# EasyEDA Pro project Cerberus_Power_V02.eprj, schematic Schematic1

## Sheets
1 P1: Board Name: Cerberus_Power_V02; Create Date: 2024-10-24; Page Name: P1; Project Name: Cerberus_Power_V02; Schematic Name: Schematic1; Update Date: 2024-10-29
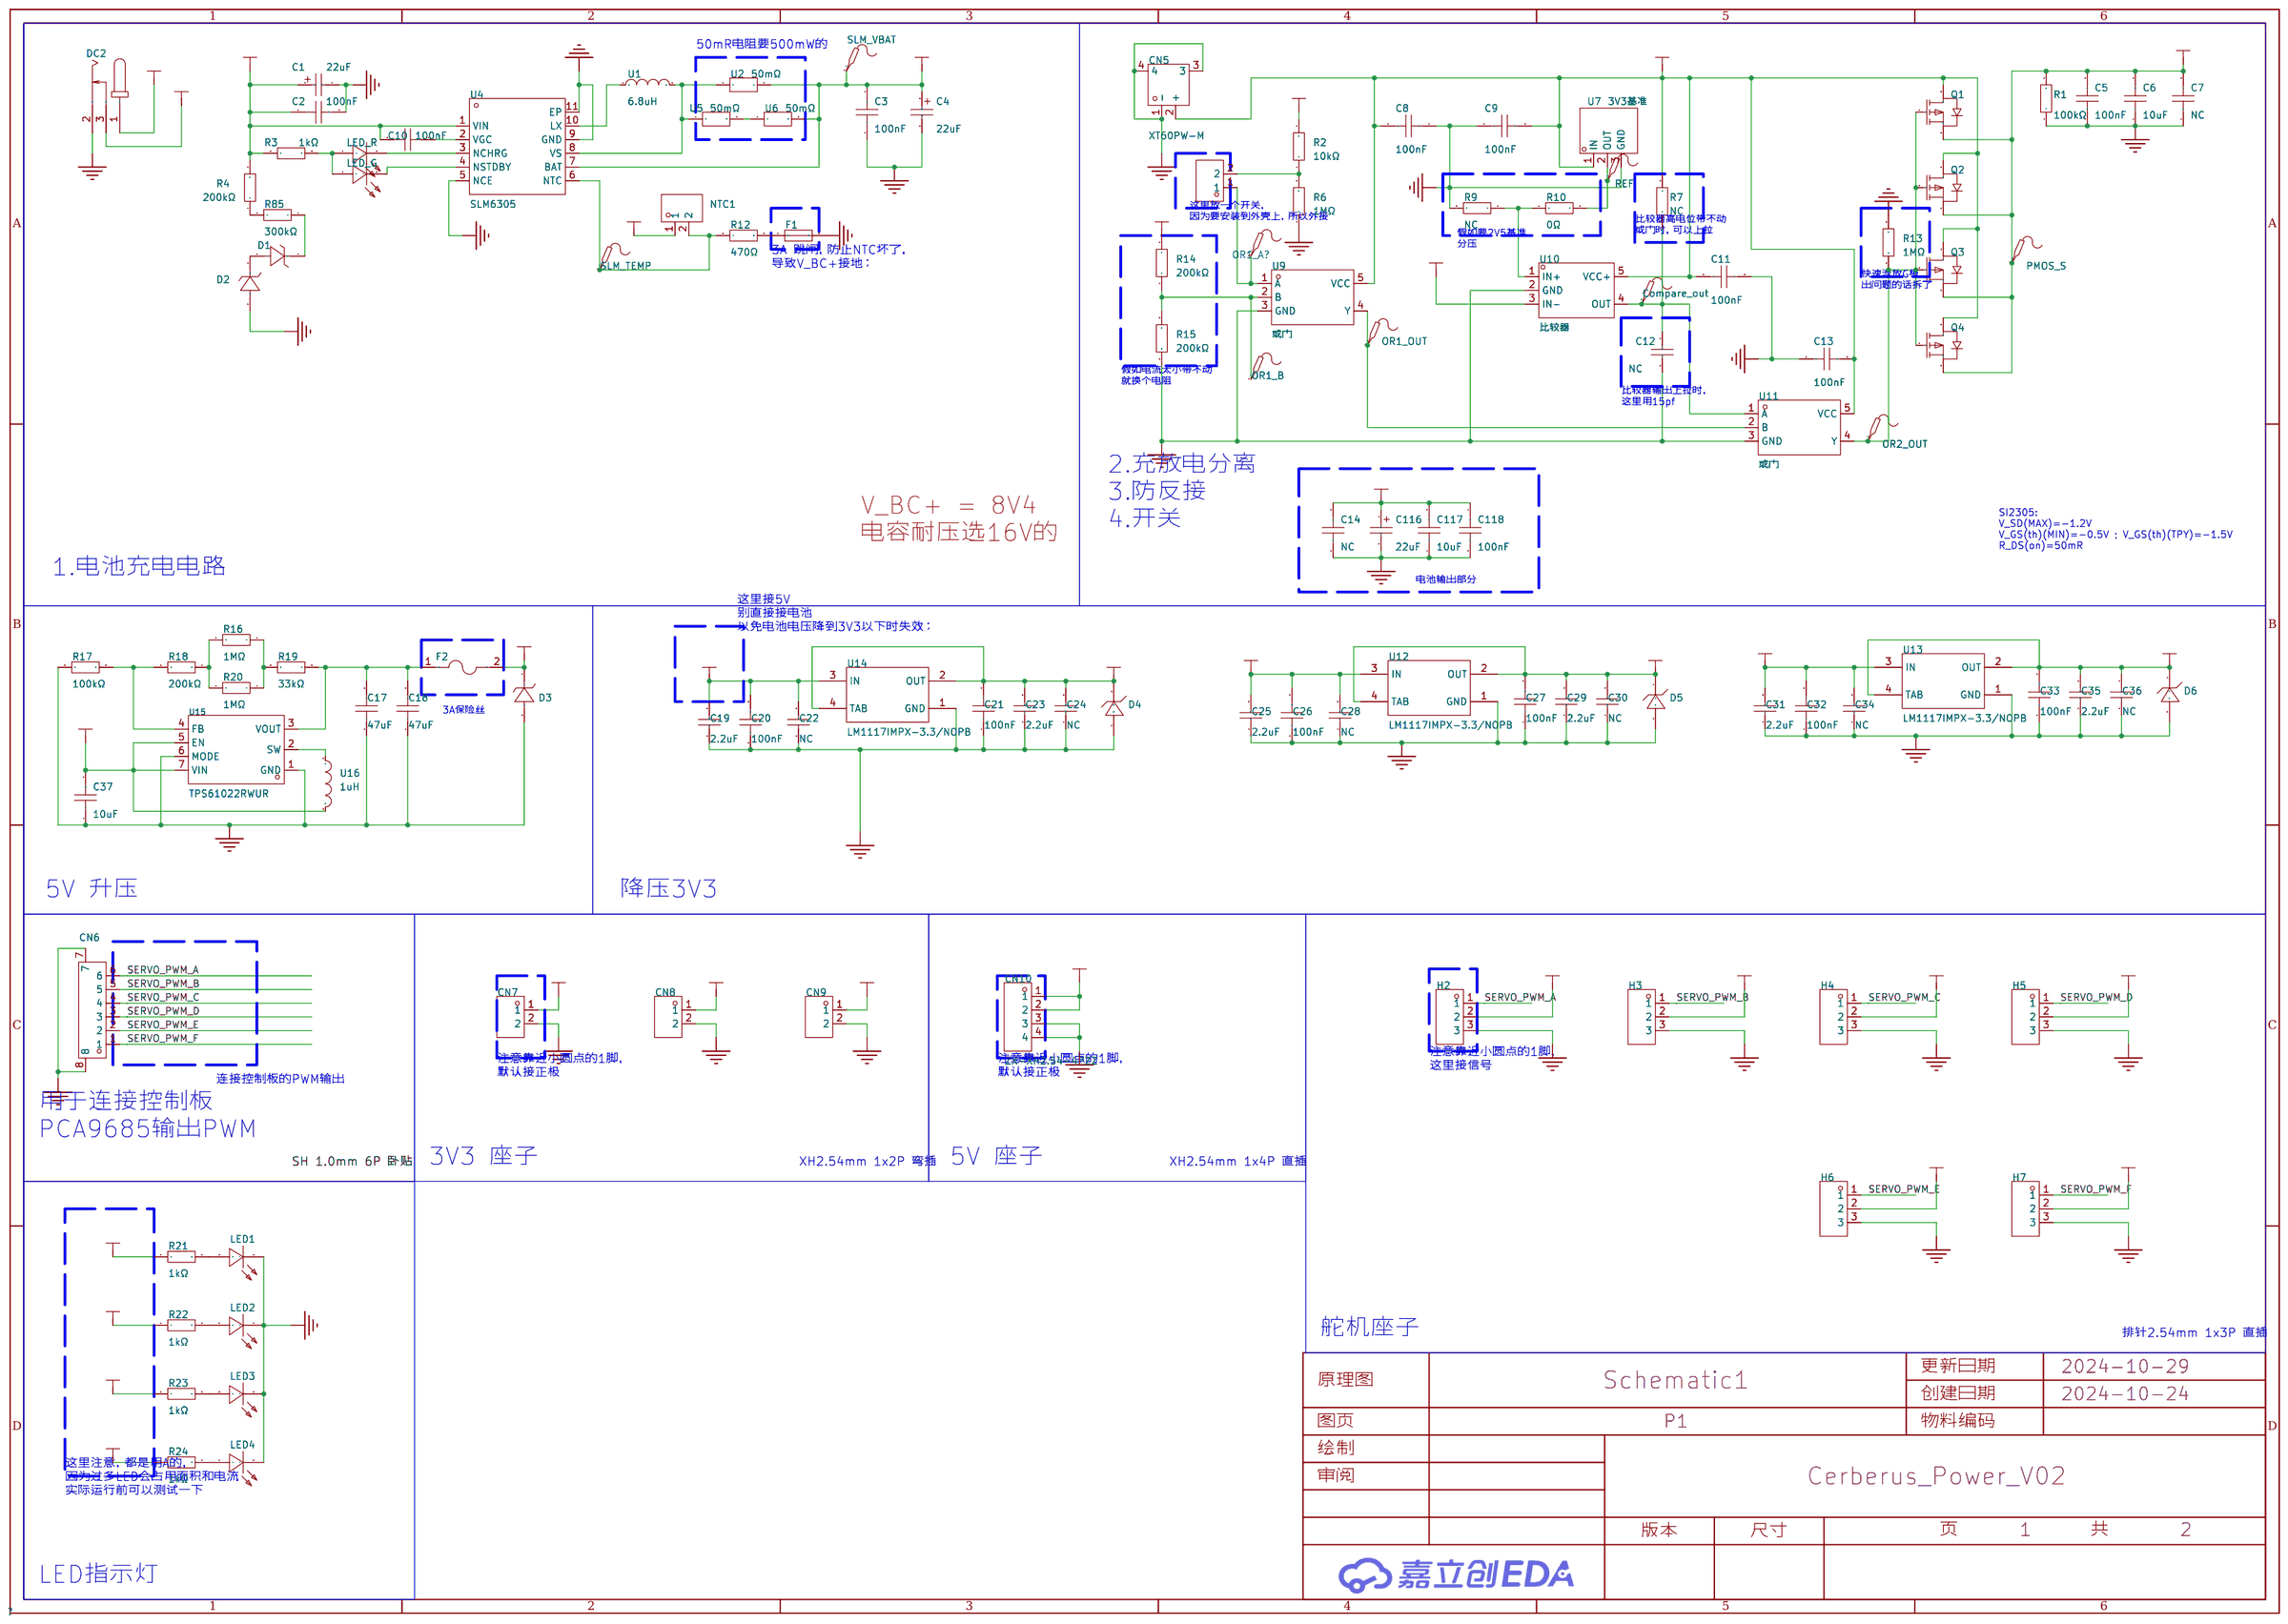
[diagram p0: P1]
2 BOOST 7V4: Create Date: 2024-10-26; Page Name: BOOST 7V4; Update Date: 2024-10-28; Company: 嘉立创EDA; Page Size: A4; Version: V1.0
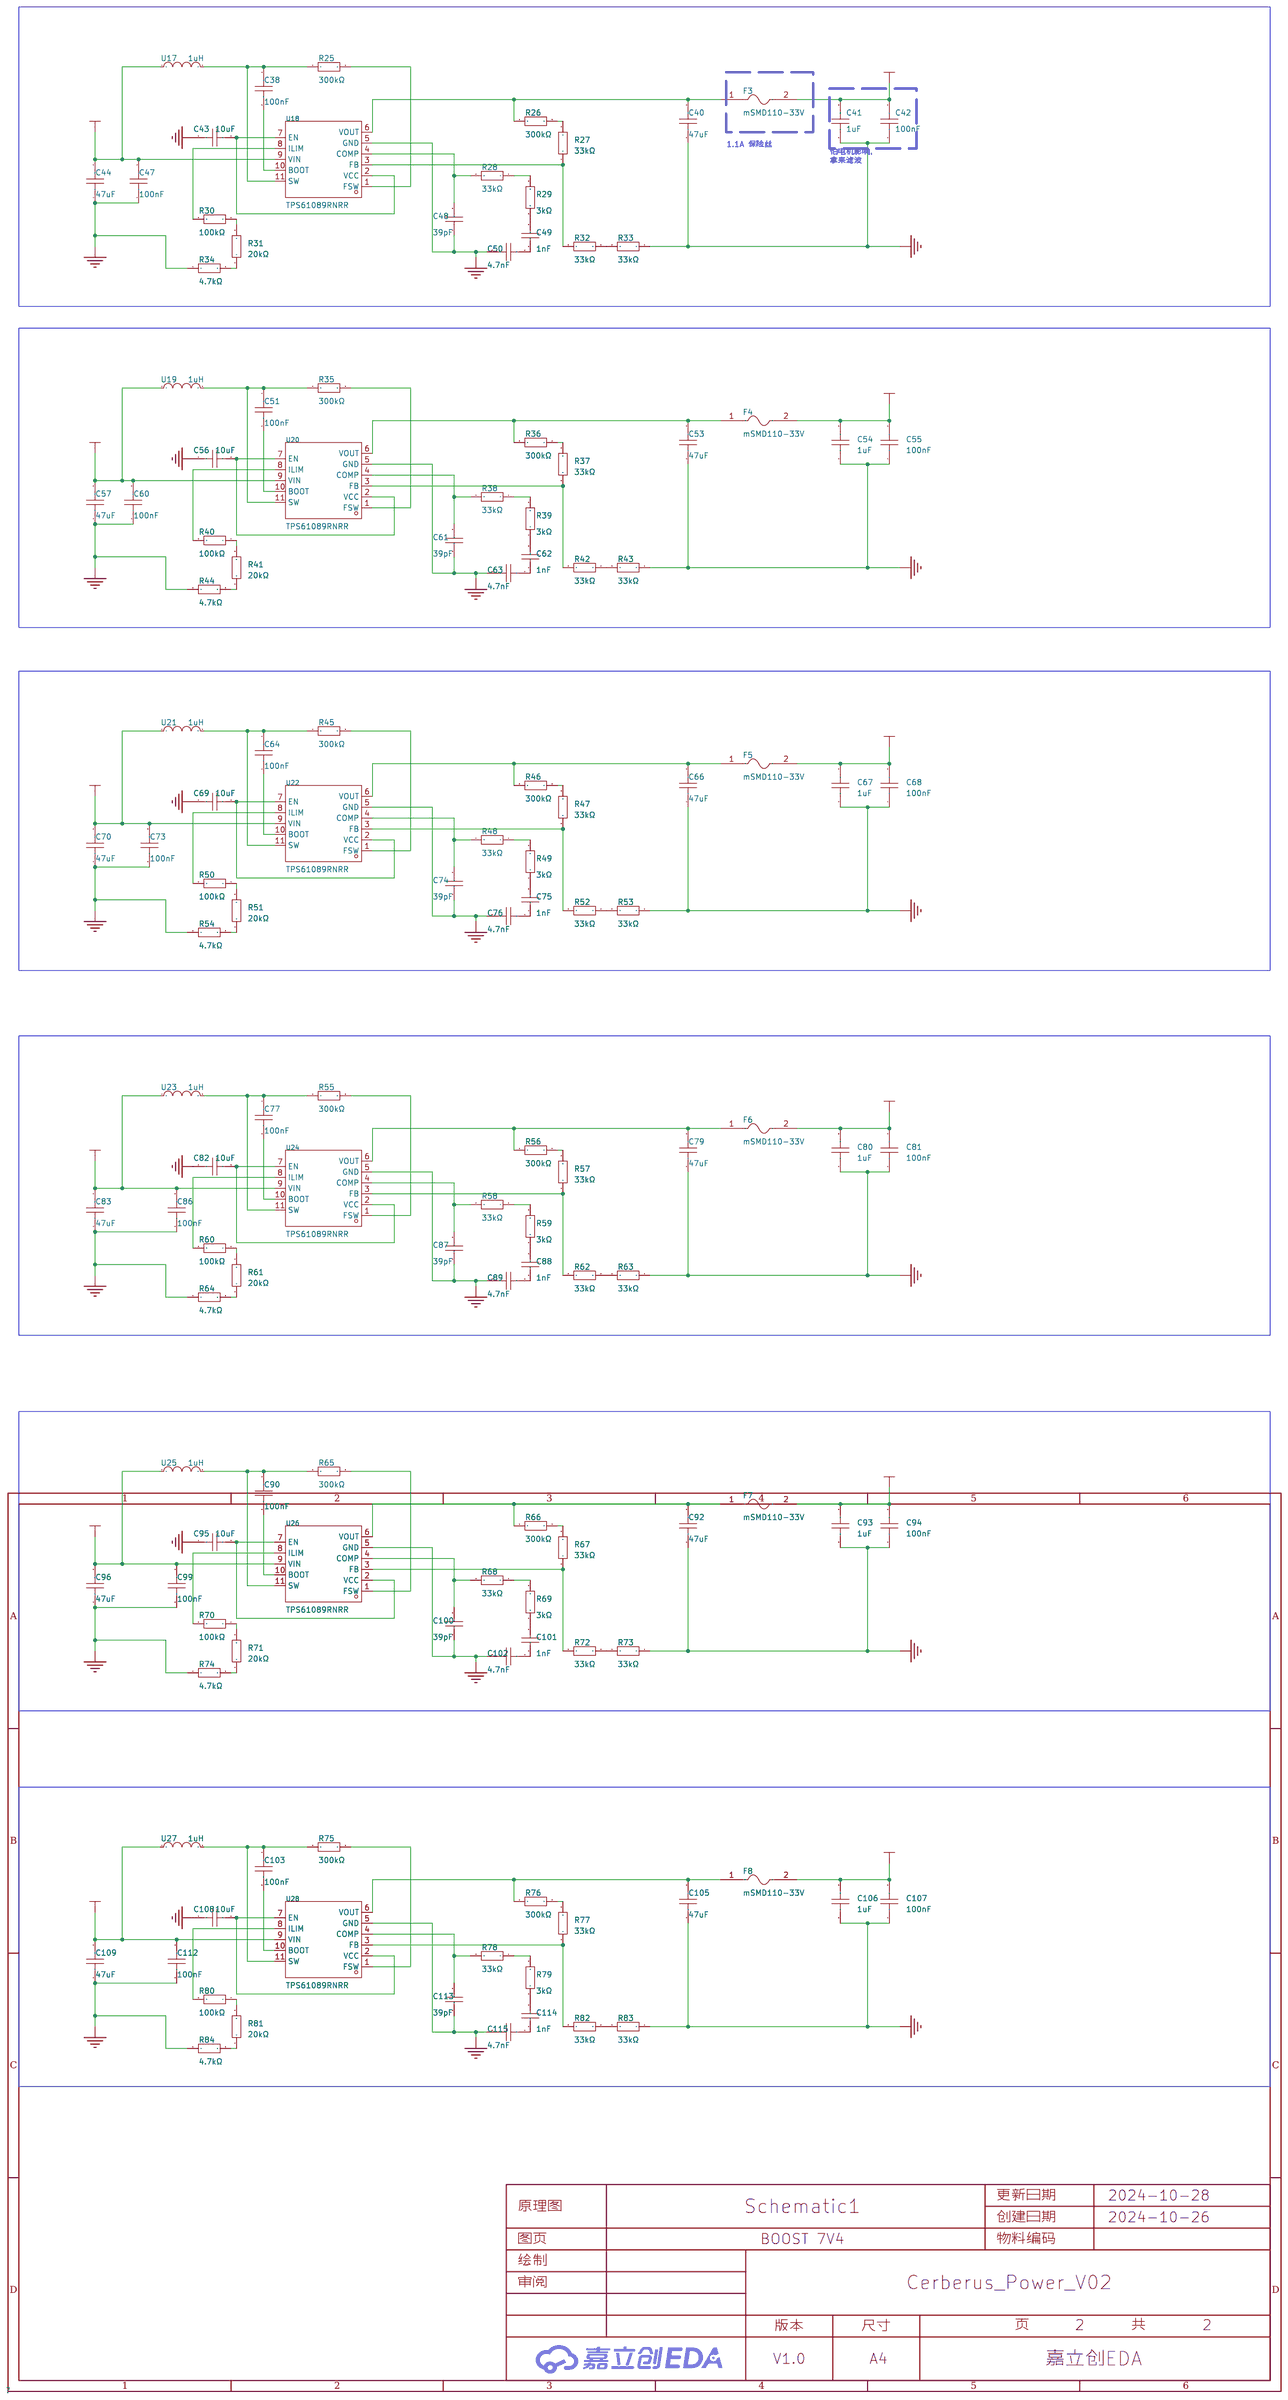
[diagram p1: BOOST 7V4]

## Parts
sheet BOOST 7V4
C38  100nF  [C0603]
C40  47uF  [C0805]
C41  1uF  [C0603]
C42  100nF  [C0603]
C43  10uF  [C0603]
C44  47uF  [C0805]
C47  100nF  [C0603]
C48  39pF  [C0603]
C49  1nF  [C0603]
C50  4.7nF  [C0603]
C51  100nF  [C0603]
C53  47uF  [C0805]
C54  1uF  [C0603]
C55  100nF  [C0603]
C56  10uF  [C0603]
C57  47uF  [C0805]
C60  100nF  [C0603]
C61  39pF  [C0603]
C62  1nF  [C0603]
C63  4.7nF  [C0603]
C64  100nF  [C0603]
C66  47uF  [C0805]
C67  1uF  [C0603]
C68  100nF  [C0603]
C69  10uF  [C0603]
C70  47uF  [C0805]
C73  100nF  [C0603]
C74  39pF  [C0603]
C75  1nF  [C0603]
C76  4.7nF  [C0603]
C77  100nF  [C0603]
C79  47uF  [C0805]
C80  1uF  [C0603]
C81  100nF  [C0603]
C82  10uF  [C0603]
C83  47uF  [C0805]
C86  100nF  [C0603]
C87  39pF  [C0603]
C88  1nF  [C0603]
C89  4.7nF  [C0603]
C90  100nF  [C0603]
C92  47uF  [C0805]
C93  1uF  [C0603]
C94  100nF  [C0603]
C95  10uF  [C0603]
C96  47uF  [C0805]
C99  100nF  [C0603]
C100  39pF  [C0603]
C101  1nF  [C0603]
C102  4.7nF  [C0603]
C103  100nF  [C0603]
C105  47uF  [C0805]
C106  1uF  [C0603]
C107  100nF  [C0603]
C108  10uF  [C0603]
C109  47uF  [C0805]
C112  100nF  [C0603]
C113  39pF  [C0603]
C114  1nF  [C0603]
C115  4.7nF  [C0603]
F3  mSMD110-33V  [F1812]
F4  mSMD110-33V  [F1812]
F5  mSMD110-33V  [F1812]
F6  mSMD110-33V  [F1812]
F7  mSMD110-33V  [F1812]
F8  mSMD110-33V  [F1812]
R25  300kΩ  [R0603]
R26  300kΩ  [R0603]
R27  33kΩ  [R0603]
R28  33kΩ  [R0603]
R29  3kΩ  [R0603]
R30  100kΩ  [R0603]
R31  20kΩ  [R0603]
R32  33kΩ  [R0603]
R33  33kΩ  [R0603]
R34  4.7kΩ  [R0603]
R35  300kΩ  [R0603]
R36  300kΩ  [R0603]
R37  33kΩ  [R0603]
R38  33kΩ  [R0603]
R39  3kΩ  [R0603]
R40  100kΩ  [R0603]
R41  20kΩ  [R0603]
R42  33kΩ  [R0603]
R43  33kΩ  [R0603]
R44  4.7kΩ  [R0603]
R45  300kΩ  [R0603]
R46  300kΩ  [R0603]
R47  33kΩ  [R0603]
R48  33kΩ  [R0603]
R49  3kΩ  [R0603]
R50  100kΩ  [R0603]
R51  20kΩ  [R0603]
R52  33kΩ  [R0603]
R53  33kΩ  [R0603]
R54  4.7kΩ  [R0603]
R55  300kΩ  [R0603]
R56  300kΩ  [R0603]
R57  33kΩ  [R0603]
R58  33kΩ  [R0603]
R59  3kΩ  [R0603]
R60  100kΩ  [R0603]
R61  20kΩ  [R0603]
R62  33kΩ  [R0603]
R63  33kΩ  [R0603]
R64  4.7kΩ  [R0603]
R65  300kΩ  [R0603]
R66  300kΩ  [R0603]
R67  33kΩ  [R0603]
R68  33kΩ  [R0603]
R69  3kΩ  [R0603]
R70  100kΩ  [R0603]
R71  20kΩ  [R0603]
R72  33kΩ  [R0603]
R73  33kΩ  [R0603]
R74  4.7kΩ  [R0603]
R75  300kΩ  [R0603]
R76  300kΩ  [R0603]
R77  33kΩ  [R0603]
R78  33kΩ  [R0603]
R79  3kΩ  [R0603]
R80  100kΩ  [R0603]
R81  20kΩ  [R0603]
R82  33kΩ  [R0603]
R83  33kΩ  [R0603]
R84  4.7kΩ  [R0603]
U17  1uH  [IND-SMD_L7.0-W6.6]
U18  TPS61089RNRR  [VQFN-HR_L2.5-W2.0-P0.50-TL-EP]
U19  1uH  [IND-SMD_L7.0-W6.6]
U20  TPS61089RNRR  [VQFN-HR_L2.5-W2.0-P0.50-TL-EP]
U21  1uH  [IND-SMD_L7.0-W6.6]
U22  TPS61089RNRR  [VQFN-HR_L2.5-W2.0-P0.50-TL-EP]
U23  1uH  [IND-SMD_L7.0-W6.6]
U24  TPS61089RNRR  [VQFN-HR_L2.5-W2.0-P0.50-TL-EP]
U25  1uH  [IND-SMD_L7.0-W6.6]
U26  TPS61089RNRR  [VQFN-HR_L2.5-W2.0-P0.50-TL-EP]
U27  1uH  [IND-SMD_L7.0-W6.6]
U28  TPS61089RNRR  [VQFN-HR_L2.5-W2.0-P0.50-TL-EP]
sheet P1
C1  22uF  [CASE-B_3528]
C2  100nF  [C0603]
C3  100nF  [C0603]
C4  22uF  [CASE-B_3528]
C5  100nF  [C0603]
C6  10uF  [C0603]
C7  22uF  [C0603]
C8  100nF  [C0603]
C9  100nF  [C0603]
C10  100nF  [C0603]
C11  100nF  [C0603]
C12  15pF  [C0603]
C13  100nF  [C0603]
C14  NC  [C0603]
C17  47uF  [C0805]
C18  47uF  [C0805]
C19  2.2uF  [C0603]
C20  100nF  [C0603]
C21  100nF  [C0603]
C22  NC  [C0603]
C23  2.2uF  [C0603]
C24  NC  [C0603]
C25  2.2uF  [C0603]
C26  100nF  [C0603]
C27  100nF  [C0603]
C28  NC  [C0603]
C29  2.2uF  [C0603]
C30  NC  [C0603]
C31  2.2uF  [C0603]
C32  100nF  [C0603]
C33  100nF  [C0603]
C34  NC  [C0603]
C35  2.2uF  [C0603]
C36  NC  [C0603]
C37  10uF  [C0603]
C116  22uF  [CASE-B_3528]
C117  10uF  [C0603]
C118  100nF  [C0603]
CN5  XT60PW-M  [CONN-TH_XT60PW-M]
CN6  WAFER-SH1.0-6PWB  [CONN-SMD_6P-P1.00_XUNPU_WAFER-SH1.0-6PWB]
CN7  ZX-XH2.54-2PWZ  [CONN-TH_2P-P2.50_ZX-XH2.54-2PWZ]
CN8  ZX-XH2.54-2PWZ  [CONN-TH_2P-P2.50_ZX-XH2.54-2PWZ]
CN9  ZX-XH2.54-2PWZ  [CONN-TH_2P-P2.50_ZX-XH2.54-2PWZ]
CN10  ZX-XH2.54-4PZZ  [CONN-TH_4P-P2.50_4PIN]
Compare_out  -  [Test-Point-0.5mm]
D1  BZT52B5V1S  [sod-323_l1.7-w1.3-ls2.6-rd]
D2  BZT52C3V3S  [sod-323_l1.7-w1.3-ls2.6-rd]
D3  BZT52B5V1S  [sod-323_l1.7-w1.3-ls2.6-rd]
D4  BZT52C3V3S  [SOD-323_L1.8-W1.3-LS2.5-RD]
D5  BZT52C3V3S  [SOD-323_L1.8-W1.3-LS2.5-RD]
D6  BZT52C3V3S  [SOD-323_L1.8-W1.3-LS2.5-RD]
DC2  DC005  [DC-IN-TH_DC005]
F1  BSMD1812-150-24V  [F1812]
F2  JFC1206-1300FS  [F1206]
H1  PZ254V-11-02P  [HDR-TH_2P-P2.54-V-M]
H2  PZ254V-11-03P  [HDR-TH_3P-P2.54-V-M]
H3  PZ254V-11-03P  [HDR-TH_3P-P2.54-V-M]
H4  PZ254V-11-03P  [HDR-TH_3P-P2.54-V-M]
H5  PZ254V-11-03P  [HDR-TH_3P-P2.54-V-M]
H6  PZ254V-11-03P  [HDR-TH_3P-P2.54-V-M]
H7  PZ254V-11-03P  [HDR-TH_3P-P2.54-V-M]
LED1  NCD0805R1  [LED0805-R-RD]
LED2  NCD0805R1  [LED0805-R-RD]
LED3  NCD0805R1  [LED0805-R-RD]
LED4  NCD0805R1  [LED0805-R-RD]
LED_G  NCD0805R1  [LED0805-R-RD]
LED_R  NCD0805R1  [LED0805-R-RD]
NTC1  ZX-XH2.54-2PZZ  [CONN-TH_2P-P2.50_HX25003-2A]
OR1_A?#1  -  [Test-Point-0.5mm]
OR1_B  -  [Test-Point-0.5mm]
OR1_OUT  -  [Test-Point-0.5mm]
OR2_OUT  -  [Test-Point-0.5mm]
PMOS_S  -  [Test-Point-0.5mm]
Q1  SI2305  [SOT-23-3_L2.9-W1.6-P1.90-LS2.8-BR]
Q2  SI2305  [SOT-23-3_L2.9-W1.6-P1.90-LS2.8-BR]
Q3  SI2305  [SOT-23-3_L2.9-W1.6-P1.90-LS2.8-BR]
Q4  SI2305  [SOT-23-3_L2.9-W1.6-P1.90-LS2.8-BR]
R1  100kΩ  [R1206]
R2  10kΩ  [R0402]
R3  1kΩ  [R0603]
R4  200kΩ  [R0603]
R6  1MΩ  [R0402]
R7  4.7kΩ  [R0603]
R9  10kΩ  [R0402]
R10  0Ω  [R0603]
R12  470Ω  [R0603]
R13  1MΩ  [R0603]
R14  200kΩ  [R0603]
R15  200kΩ  [R0603]
R16  1MΩ  [R0402]
R17  100kΩ  [R0603]
R18  200kΩ  [R0603]
R19  33kΩ  [R0603]
R20  1MΩ  [R0402]
R21  1kΩ  [R0603]
R22  1kΩ  [R0603]
R23  1kΩ  [R0603]
R24  1kΩ  [R0603]
R85  300kΩ  [R0603]
REF  -  [Test-Point-0.5mm]
SLM_TEMP  -  [Test-Point-0.5mm]
SLM_VBAT  -  [Test-Point-0.5mm]
U1  6.8uH  [IND-SMD_L5.7-W5.2]
U2  50mΩ  [R1206]
U4  SLM6305  [TDFN-10_L3.0-W3.0-P0.50-BL-EP]
U5  50mΩ  [R1206]
U6  50mΩ  [R1206]
U7  3V3基准  [SOT-23-3_L3.0-W1.7-P0.95-LS2.9-BR]
U9  或门  [SOT-23-5_L2.9-W1.6-P0.95-LS2.8-BR]
U10  比较器  [SOT-23-5_L3.0-W1.7-P0.95-LS2.8-BR]
U11  或门  [SOT-23-5_L2.9-W1.6-P0.95-LS2.8-BR]
U12  LM1117IMPX-3.3/NOPB  [SOT-223_L6.5-W3.5-P2.30-LS7.0-BR]
U13  LM1117IMPX-3.3/NOPB  [SOT-223_L6.5-W3.5-P2.30-LS7.0-BR]
U14  LM1117IMPX-3.3/NOPB  [SOT-223_L6.5-W3.5-P2.30-LS7.0-BR]
U15  TPS61022RWUR  [VQFN-7_L2.0-W2.0-P0.55-TL_RWU]
U16  1uH  [IND-SMD_L7.0-W6.6]

## Library data of the parts
C2 C3 C5 C8-C11 C13 C20 C21 C26 C27 C32 C33 C38 C42 C47 C51 C55 C60 C64 C68 C73 C77 C81 C86 C90 C94 C99 C103 C107 C112 C118 = CGA0603X7R104K500JT: LCSC Part Name: 100nF ±10% 50V; Supplier Part: C6119867; Manufacturer: HRE(芯声); Supplier Footprint: 0603; JLCPCB Part Class: 扩展库; Supplier: LCSC; Tolerance: ±10%; Voltage Rated: 50V; Temperature Coefficient: X7R
C17 C18 C40 C44 C53 C57 C66 C70 C79 C83 C92 C96 C105 C109 = CGA0805X5R476M100MT: LCSC Part Name: 47uF ±20% 10V; Supplier Part: C6119904; Manufacturer: HRE(芯声); Supplier Footprint: 0805; JLCPCB Part Class: 扩展库; Supplier: LCSC; Tolerance: ±20%; Voltage Rated: 10V; Temperature Coefficient: X5R
C41 C54 C67 C80 C93 C106 = CGA0603X5R105K160JT: LCSC Part Name: 1uF ±10% 16V; Supplier Part: C6119849; Manufacturer: HRE(芯声); Supplier Footprint: 0603; JLCPCB Part Class: 扩展库; Supplier: LCSC; Tolerance: ±10%; Voltage Rated: 16V; Temperature Coefficient: X5R
C6 C14 C37 C43 C56 C69 C82 C95 C108 C117 = HGC0603R5106M160NTHJ: LCSC Part Name: 10uF ±20% 16V; Supplier Part: C7472959; Manufacturer: Chinocera(华瓷); Supplier Footprint: 0603; JLCPCB Part Class: 扩展库; Datasheet: https://atta.szlcsc.com/upload/public/pdf/source/20240320/FAC3FEC40A78BC5CCCE96C232A94D860.pdf; Supplier: LCSC; Tolerance: ±20%; Voltage Rated: 16V; Temperature Coefficient: X5R
C48 C61 C74 C87 C100 C113 = CC0603JRNPO9BN390: LCSC Part Name: 39pF ±5% 50V; Supplier Part: C107049; Manufacturer: YAGEO(国巨); Supplier Footprint: 0603; JLCPCB Part Class: 扩展库; Datasheet: https://atta.szlcsc.com/upload/public/pdf/source/20170914/C128857_1505359892143968080.pdf; Supplier: LCSC; Tolerance: ±5%; Voltage Rated: 50V; Temperature Coefficient: NP0
C49 C62 C75 C88 C101 C114 = CC0603KRX7R9BB102: LCSC Part Name: 1nF ±10% 50V; Supplier Part: C100040; Manufacturer: YAGEO(国巨); Supplier Footprint: 0603; JLCPCB Part Class: 扩展库; Datasheet: https://atta.szlcsc.com/upload/public/pdf/source/20180910/C282072_33301C7F631E79921B82A8DAC6BCC5B3.pdf; Supplier: LCSC; Tolerance: ±10%; Voltage Rated: 50V; Temperature Coefficient: X7R
C50 C63 C76 C89 C102 C115 = CGA0603X7R472K500JT: LCSC Part Name: 4.7nF ±10% 50V; Supplier Part: C7503499; Manufacturer: HRE(芯声); Supplier Footprint: 0603; JLCPCB Part Class: 扩展库; Supplier: LCSC; Tolerance: ±10%; Voltage Rated: 50V; Temperature Coefficient: X7R
F3-F8 = mSMD110-33V: LCSC Part Name: 33V 1.1A 1812自恢复; Supplier Part: C70119; Manufacturer: 台湾陆海; Supplier Footprint: 1812; JLCPCB Part Class: 扩展库; Datasheet: https://atta.szlcsc.com/upload/public/pdf/source/20220506/AB1AE108CC65B75A3068EC09620F583D.pdf; Supplier: LCSC; Operating Voltage (Max): 33V; Current Rating (Max): 100A; Hold Current: 1.1A; Trip Current: 2.2A
R25 R26 R35 R36 R45 R46 R55 R56 R65 R66 R75 R76 R85 = 0603WAF3003T5E: LCSC Part Name: 300kΩ ±1% 100mW 厚膜电阻; Supplier Part: C23024; Manufacturer: UNI-ROYAL(厚声); Supplier Footprint: 0603; JLCPCB Part Class: 基础库; Datasheet: https://atta.szlcsc.com/upload/public/pdf/source/20200306/C422600_1E6D84923E4A46A82E41ADD87F860B5C.pdf; Supplier: LCSC; Type: 厚膜电阻; Tolerance: ±1%; Power(Watts): 100mW; Overload Voltage (Max): 75V; Temperature Coefficient: ±100ppm/℃; Operating Temperature Range: -55℃~+155℃
R19 R27 R28 R32 R33 R37 R38 R42 R43 R47 R48 R52 R53 R57 R58 R62 R63 R67 R68 R72 R73 R77 R78 R82 R83 = 0603WAF3302T5E: LCSC Part Name: 33kΩ ±1% 100mW 厚膜电阻; Supplier Part: C4216; Manufacturer: UNI-ROYAL(厚声); Supplier Footprint: 0603; JLCPCB Part Class: 基础库; Datasheet: https://atta.szlcsc.com/upload/public/pdf/source/20200306/C422600_1E6D84923E4A46A82E41ADD87F860B5C.pdf; Supplier: LCSC; Type: 厚膜电阻; Tolerance: ±1%; Power(Watts): 100mW; Overload Voltage (Max): 75V; Temperature Coefficient: ±100ppm/℃; Operating Temperature Range: -55℃~+155℃
R29 R39 R49 R59 R69 R79 = 0603WAF3001T5E: LCSC Part Name: 3kΩ ±1% 100mW 厚膜电阻; Supplier Part: C4211; Manufacturer: UNI-ROYAL(厚声); Supplier Footprint: 0603; JLCPCB Part Class: 基础库; Datasheet: https://atta.szlcsc.com/upload/public/pdf/source/20200306/C422600_1E6D84923E4A46A82E41ADD87F860B5C.pdf; Supplier: LCSC; Type: 厚膜电阻; Tolerance: ±1%; Power(Watts): 100mW; Overload Voltage (Max): 75V; Temperature Coefficient: ±100ppm/℃; Operating Temperature Range: -55℃~+155℃
R17 R30 R40 R50 R60 R70 R80 = 0603WAF1003T5E: LCSC Part Name: 100kΩ ±1% 100mW 厚膜电阻; Supplier Part: C25803; Manufacturer: UNI-ROYAL(厚声); Supplier Footprint: 0603; JLCPCB Part Class: 基础库; Datasheet: https://atta.szlcsc.com/upload/public/pdf/source/20200306/C422600_1E6D84923E4A46A82E41ADD87F860B5C.pdf; Supplier: LCSC; Type: 厚膜电阻; Tolerance: ±1%; Power(Watts): 100mW; Overload Voltage (Max): 75V; Temperature Coefficient: ±100ppm/℃; Operating Temperature Range: -55℃~+155℃
R31 R41 R51 R61 R71 R81 = 0603WAF2002T5E: LCSC Part Name: 20kΩ ±1% 100mW 厚膜电阻; Supplier Part: C4184; Manufacturer: UNI-ROYAL(厚声); Supplier Footprint: 0603; JLCPCB Part Class: 基础库; Datasheet: https://atta.szlcsc.com/upload/public/pdf/source/20200306/C422600_1E6D84923E4A46A82E41ADD87F860B5C.pdf; Supplier: LCSC; Type: 厚膜电阻; Tolerance: ±1%; Power(Watts): 100mW; Overload Voltage (Max): 75V; Temperature Coefficient: ±100ppm/℃; Operating Temperature Range: -55℃~+155℃
R7 R34 R44 R54 R64 R74 R84 = 0603WAF4701T5E: LCSC Part Name: 4.7kΩ ±1% 100mW 厚膜电阻; Supplier Part: C23162; Manufacturer: UNI-ROYAL(厚声); Supplier Footprint: 0603; JLCPCB Part Class: 基础库; Datasheet: https://atta.szlcsc.com/upload/public/pdf/source/20200306/C422600_1E6D84923E4A46A82E41ADD87F860B5C.pdf; Supplier: LCSC; Type: 厚膜电阻; Tolerance: ±1%; Power(Watts): 100mW; Overload Voltage (Max): 75V; Temperature Coefficient: ±100ppm/℃; Operating Temperature Range: -55℃~+155℃
U16 U17 U19 U21 U23 U25 U27 = XR0630-1R0M: LCSC Part Name: 1uH ±20% 15A; Supplier Part: C5307624; Manufacturer: XR(祥如); Supplier Footprint: SMD,0630; JLCPCB Part Class: 扩展库; Datasheet: https://atta.szlcsc.com/upload/public/pdf/source/20240328/B63E6723F5234A6B1F84C3B72E885323.pdf; Supplier: LCSC; Tolerance: ±20%; Rated Current: 12A; Saturation Current (Isat): 15A; DC Resistance (DCR): 7.4mΩ; Type: 一体成型电感
U18 U20 U22 U24 U26 U28 = TPS61089RNRR: Supplier Part: C165129; Manufacturer: TI(德州仪器); Supplier Footprint: VQFN-11-HR-EP(2x2.5); JLCPCB Part Class: 扩展库; Datasheet: https://www.ti.com/cn/lit/gpn/tps61089; Supplier: LCSC; Function: 升压型; Output Type: 可调; Input Voltage: 2.7V~12V; Output Voltage: 4.5V~12.6V; Output Current (Max): 7A; Switching Frequency: 2.2MHz; Operating Temperature: -40℃~+125℃@(TJ); Synchronous Rectification: 是; Number of Outputs: 1; Topology: 升压式; Switch tube (built-in/external): 内置
C1 C4 C116 = TAJB226K016RNJ: LCSC Part Name: 22uF ±10% 16V; Supplier Part: C8020; Manufacturer: Kyocera AVX; Supplier Footprint: CASE-B-3528; JLCPCB Part Class: 扩展库; Datasheet: https://atta.szlcsc.com/upload/public/pdf/source/20160107/1457707750344.pdf; Supplier: LCSC; Tolerance: ±10%; Rated Voltage: 16V; Equivalent Series Resistance(ESR): 2.3Ω@100kHz; Operating Temperature: -55℃~+125℃
C7 = CGA0603X5R226M160JT: LCSC Part Name: 22uF ±20% 16V; Supplier Part: C6119868; Manufacturer: HRE(芯声); Supplier Footprint: 0603; JLCPCB Part Class: 扩展库; Supplier: LCSC; Tolerance: ±20%; Voltage Rated: 16V; Temperature Coefficient: X5R
C12 = CL10C150JB8NNNC: LCSC Part Name: 15pF ±5% 50V; Supplier Part: C1644; Manufacturer: SAMSUNG(三星); Supplier Footprint: 0603; JLCPCB Part Class: 基础库; Datasheet: https://atta.szlcsc.com/upload/public/pdf/source/20160218/1457707763339.pdf; Supplier: LCSC; Tolerance: ±5%; Voltage Rated: 50V; Temperature Coefficient: C0G
C19 C22-C25 C28-C31 C34-C36 = CL10A225KO8NNNC: LCSC Part Name: 2.2uF ±10% 16V; Supplier Part: C23630; Manufacturer: SAMSUNG(三星); Supplier Footprint: 0603; JLCPCB Part Class: 基础库; Datasheet: https://atta.szlcsc.com/upload/public/pdf/source/20160218/1457707763339.pdf; Supplier: LCSC; Tolerance: ±10%; Voltage Rated: 16V; Temperature Coefficient: X5R
CN5 = XT60PW-M: LCSC Part Name: AMASS(艾迈斯)航模插头xt60连接器150公母对接pw锂电池公头 板插卧式XT60PW-M; Supplier Part: C98732; Manufacturer: AMASS(艾迈斯); JLCPCB Part Class: 扩展库; Datasheet: https://atta.szlcsc.com/upload/public/pdf/source/20240118/44A3DCFF53BE25DC65378AFFB21277A4.pdf; Supplier: LCSC; Brand: 艾迈斯; Type: 卧式插头; Colour: 黄色; InterfaceType: 公头
CN6 = WAFER-SH1.0-6PWB: LCSC Part Name: 1x6P 间距:1mm 卧贴; Supplier Part: C3029345; Manufacturer: XUNPU(讯普); Supplier Footprint: SMD,P=1mm,卧贴; JLCPCB Part Class: 扩展库; Datasheet: https://atta.szlcsc.com/upload/public/pdf/source/20220527/1879B8210BD3B2006BCEAC1A40D397B6.pdf; Supplier: LCSC; Pins Structure: 1x6P; Pitch: 1mm; Mounting Style: 卧贴; Number of Pins: 6P; Number of Rows: 1; Number of PINs Per Row: 6; Current Rating (Max): 1A; Operating Temperature Range: -25℃~+85℃
CN7-CN9 = ZX-XH2.54-2PWZ: Supplier Part: C7429641; Manufacturer: Megastar(兆星); Supplier Footprint: 弯插,P=2.54mm; JLCPCB Part Class: 扩展库; Datasheet: https://atta.szlcsc.com/upload/public/pdf/source/20230619/56AE8F2E01CDFEAA97FC89B5ED558AB5.pdf; Supplier: LCSC; Pins Structure: 1x2P; Pitch: 2.54mm; Mounting Style: 弯插; Reference Series: XH; Number of Pins: 2P; Number of Rows: 1; Number of PINs Per Row: 2; Current Rating (Max): 3A; Contact Material: 黄铜; Contact Plating: 锡; Operating Temperature Range: -25℃~+85℃
CN10 = ZX-XH2.54-4PZZ: Supplier Part: C7429634; Manufacturer: Megastar(兆星); Supplier Footprint: 插件,P=2.5mm; JLCPCB Part Class: 扩展库; Datasheet: https://atta.szlcsc.com/upload/public/pdf/source/20230619/B529A2163E0159A644AB3383D208FB03.pdf; Supplier: LCSC; Pins Structure: 1x4P; Pitch: 2.54mm; Mounting Style: 直插; Reference Series: XH; Number of Pins: 4P; Number of Rows: 1; Number of PINs Per Row: 4; Current Rating (Max): 3A; Contact Material: 黄铜; Contact Plating: 锡; Operating Temperature Range: -25℃~+85℃
Compare_out OR1_A?#1 OR1_B OR1_OUT OR2_OUT PMOS_S REF SLM_TEMP SLM_VBAT = Test-Point
D1 D3 = BZT52B5V1S_C19077434: Supplier Part: C19077434; Manufacturer: 宏迦橙; Supplier Footprint: SOD-323; JLCPCB Part Class: 扩展库; Datasheet: https://atta.szlcsc.com/upload/public/pdf/source/20231117/03BAC117EAD9C8D6F1CB84152A6DEB92.pdf; Supplier: LCSC; Diode Configuration: 独立式; Zener Voltage (Nom): 5.1V; Reverse Leakage Current (Ir): 2uA@2V; Zener Voltage (Range): 5V~5.2V; Power Dissipation: 200mW; Zener Impedance (Zzt): 60Ω
D2 = BZT52C3V3S_C19077437: Supplier Part: C19077437; Manufacturer: 宏迦橙; Supplier Footprint: SOD-323; JLCPCB Part Class: 扩展库; Datasheet: https://atta.szlcsc.com/upload/public/pdf/source/20231117/06CD1C2A69B3FFC97FEAE4263E1B2FE9.pdf; Supplier: LCSC; Diode Configuration: 独立式; Zener Voltage (Nom): 3.3V; Reverse Leakage Current (Ir): 5uA@1V; Zener Voltage (Range): 3.1V~3.5V; Power Dissipation: 200mW; Zener Impedance (Zzt): 95Ω
D4-D6 = BZT52C3V3S_C188195: Supplier Part: C188195; Manufacturer: CJ(江苏长电/长晶); Supplier Footprint: SOD-323; JLCPCB Part Class: 扩展库; Datasheet: https://atta.szlcsc.com/upload/public/pdf/source/20180316/2B125197C2A39CB886CBCA4B5CDA3D65.pdf; Supplier: LCSC; Diode Configuration: 独立式; Zener Voltage (Nom): 3.3V; Reverse Leakage Current (Ir): 5uA@1V; Zener Voltage (Range): 3.1V~3.5V; Power Dissipation: 200mW; Zener Impedance (Zzt): 95Ω
DC2 = DC005: LCSC Part Name: DC电源插座 内径:2mm 外径:6.3mm; Supplier Part: C431533; Manufacturer: SHOU HAN(首韩); Supplier Footprint: 插件; JLCPCB Part Class: 扩展库; Datasheet: https://atta.szlcsc.com/upload/public/pdf/source/20190925/C431533_4751811035784AC1D38EBC85F7905E99.pdf; Supplier: LCSC; Connector Type: DC电源插座; Mounting Style: 弯插; Inside Contact Diameter: 2mm; Outside Contact Diameter: 6.3mm; Current Rating (Max): 500mA; Voltage Rating (Max): 30V; Operating Temperature Range: -40℃~+55℃
F1 = BSMD1812-150-24V: LCSC Part Name: 24V 1.5A 1812自恢复; Supplier Part: C883153; Manufacturer: BHFUSE(佰宏); Supplier Footprint: 1812; JLCPCB Part Class: 扩展库; Datasheet: https://atta.szlcsc.com/upload/public/pdf/source/20230512/6ED7FF50F668B3AF958C55F12246A840.pdf; Supplier: LCSC; Operating Voltage (Max): 24V; Current Rating (Max): 40A; Hold Current: 1.5A; Trip Current: 3A; Power Dissipation: 1W; Resistance - Initial (Ri) (Min): 40mΩ; Resistance - Post Trip (R1) (Max): 160mΩ; Maximum Time to Trip: 500ms; Operating Temperature: -40℃~+85℃
F2 = JFC1206-1300FS: LCSC Part Name: 贴片式保险丝; Supplier Part: C136347; Manufacturer: JDTfuse(集电通); Supplier Footprint: 1206; JLCPCB Part Class: 扩展库; Datasheet: https://atta.szlcsc.com/upload/public/pdf/source/20230515/8A56624F973AA51D74CDD59D07A1FF42.pdf; Supplier: LCSC; Type: 贴片式保险丝; Current Rating: 3A; Voltage Rating  (AC): 63V; Voltage Rating (DC): 63V; Operating Temperature: -55℃~+125℃; Breaking Capacity: 50A
H1 = PZ254V-11-02P: LCSC Part Name: 间距:2.54mm 1x2P 直插 方针; Supplier Part: C492401; Manufacturer: XFCN(兴飞); Supplier Footprint: 插件,P=2.54mm; JLCPCB Part Class: 扩展库; Datasheet: https://atta.szlcsc.com/upload/public/pdf/source/20200309/C492401_A812433581A9B211A7FFA413ADDFF0E5.pdf; Supplier: LCSC; Pin Structure: 1x2P; Pitch: 2.54mm; Circluar Pins/Square Pins: 方针; Mounting Type: 直插; Number of Rows: 单排; Number of Pins: 2P; Length of Mating Pin: 6mm; Insulation Height: 2.5mm; Length of End Connection Pin: 3mm; Contact Material: 黄铜; Operating Temperature Range: -40℃~+105℃; Color: 黑色
H2-H7 = PZ254V-11-03P: LCSC Part Name: 间距:2.54mm 1x3P 直插 方针; Supplier Part: C2937625; Manufacturer: XFCN(兴飞); Supplier Footprint: 插件,P=2.54mm; JLCPCB Part Class: 扩展库; Datasheet: https://atta.szlcsc.com/upload/public/pdf/source/20200309/C492402_8335C3D49C4E4C618838D59BB1D024C1.pdf; Supplier: LCSC; Pin Structure: 1x3P; Pitch: 2.54mm; Circluar Pins/Square Pins: 方针; Mounting Type: 直插; Number of Rows: 单排; Number of Pins: 3P; Current Rating (Max): 3A; Voltage Rating (Max): 250V; Length of Mating Pin: 6mm; Insulation Height: 2.5mm; Length of End Connection Pin: 3mm; Operating Temperature Range: -40℃~+105℃; Color: 黑色
LED1-LED4 LED_G LED_R = NCD0805R1: Supplier Part: C84256; Manufacturer: 国星光电; Supplier Footprint: 0805; JLCPCB Part Class: 基础库; Datasheet: https://atta.szlcsc.com/upload/public/pdf/source/20200820/C84256_F0A75A43B3EAD75808600A0514C76B99.pdf; Supplier: LCSC; Emitted Color: 红色; Forward Voltage (VF): 1.6V~2.6V; Power Dissipation: 65mW; Forward Current: 20mA; Dominant Wavelength: 615nm~630nm; Diode Configuration: 独立二极管; Lens Color: 无色透明透镜; Luminous Intensity: 67mcd~195mcd; Viewing Angle: 130°; Operating Temperature: -30℃~+85℃
NTC1 = ZX-XH2.54-2PZZ: Supplier Part: C7429632; Manufacturer: Megastar(兆星); Supplier Footprint: 插件,P=2.54mm; JLCPCB Part Class: 扩展库; Datasheet: https://atta.szlcsc.com/upload/public/pdf/source/20230619/19BA6947230AA44A04D3EDD65E618FD0.pdf; Supplier: LCSC; Pins Structure: 1x2P; Pitch: 2.54mm; Mounting Style: 直插; Reference Series: XH; Number of Pins: 2P; Number of Rows: 1; Number of PINs Per Row: 2; Current Rating (Max): 3A; Contact Material: 黄铜; Contact Plating: 锡; Operating Temperature Range: -25℃~+85℃
Q1-Q4 = SI2305_C727153: Supplier Part: C727153; Manufacturer: TWGMC(台湾迪嘉); Supplier Footprint: SOT-23; JLCPCB Part Class: 扩展库; Datasheet: https://atta.szlcsc.com/upload/public/pdf/source/20200827/C727153_9B9B58BE4BA2C7EB6EE72B177984B8CA.pdf; Supplier: LCSC
R1 = 1206W4J0104T5E: LCSC Part Name: 100kΩ ±5% 250mW 厚膜电阻; Supplier Part: C25647; Manufacturer: UNI-ROYAL(厚声); Supplier Footprint: 1206; JLCPCB Part Class: 扩展库; Datasheet: https://atta.szlcsc.com/upload/public/pdf/source/20200306/C422600_1E6D84923E4A46A82E41ADD87F860B5C.pdf; Supplier: LCSC; Type: 厚膜电阻; Tolerance: ±5%; Power(Watts): 250mW; Overload Voltage (Max): 200V; Temperature Coefficient: ±100ppm/℃; Operating Temperature Range: -55℃~+155℃
R2 R9 = 0402WGF1002TCE: LCSC Part Name: 10kΩ ±1% 62.5mW 厚膜电阻; Supplier Part: C25744; Manufacturer: UNI-ROYAL(厚声); Supplier Footprint: 0402; JLCPCB Part Class: 基础库; Datasheet: https://atta.szlcsc.com/upload/public/pdf/source/20200306/C422600_1E6D84923E4A46A82E41ADD87F860B5C.pdf; Supplier: LCSC; Type: 厚膜电阻; Tolerance: ±1%; Power(Watts): 62.5mW; Overload Voltage (Max): 50V; Temperature Coefficient: ±100ppm/℃; Operating Temperature Range: -55℃~+155℃
R3 R21-R24 = 0603WAF1001T5E: LCSC Part Name: 1kΩ ±1% 100mW 厚膜电阻; Supplier Part: C21190; Manufacturer: UNI-ROYAL(厚声); Supplier Footprint: 0603; JLCPCB Part Class: 基础库; Datasheet: https://atta.szlcsc.com/upload/public/pdf/source/20200306/C422600_1E6D84923E4A46A82E41ADD87F860B5C.pdf; Supplier: LCSC; Type: 厚膜电阻; Tolerance: ±1%; Power(Watts): 100mW; Overload Voltage (Max): 75V; Temperature Coefficient: ±100ppm/℃; Operating Temperature Range: -55℃~+155℃
R4 R14 R15 R18 = 0603WAF2003T5E: LCSC Part Name: 200kΩ ±1% 100mW 厚膜电阻; Supplier Part: C25811; Manufacturer: UNI-ROYAL(厚声); Supplier Footprint: 0603; JLCPCB Part Class: 基础库; Datasheet: https://atta.szlcsc.com/upload/public/pdf/source/20200306/C422600_1E6D84923E4A46A82E41ADD87F860B5C.pdf; Supplier: LCSC; Type: 厚膜电阻; Tolerance: ±1%; Power(Watts): 100mW; Overload Voltage (Max): 75V; Temperature Coefficient: ±100ppm/℃; Operating Temperature Range: -55℃~+155℃
R6 R16 R20 = 0402WGF1004TCE: LCSC Part Name: 1MΩ ±1% 62.5mW 厚膜电阻; Supplier Part: C26083; Manufacturer: UNI-ROYAL(厚声); Supplier Footprint: 0402; JLCPCB Part Class: 基础库; Datasheet: https://atta.szlcsc.com/upload/public/pdf/source/20200306/C422600_1E6D84923E4A46A82E41ADD87F860B5C.pdf; Supplier: LCSC; Type: 厚膜电阻; Tolerance: ±1%; Power(Watts): 62.5mW; Overload Voltage (Max): 50V; Temperature Coefficient: ±100ppm/℃; Operating Temperature Range: -55℃~+155℃
R10 = 0603WAF0000T5E: LCSC Part Name: 0Ω ±1% 100mW 厚膜电阻; Supplier Part: C21189; Manufacturer: UNI-ROYAL(厚声); Supplier Footprint: 0603; JLCPCB Part Class: 基础库; Datasheet: https://atta.szlcsc.com/upload/public/pdf/source/20200306/C422600_1E6D84923E4A46A82E41ADD87F860B5C.pdf; Supplier: LCSC; Type: 厚膜电阻; Tolerance: ±1%; Power(Watts): 100mW; Overload Voltage (Max): 75V; Operating Temperature Range: -55℃~+155℃
R12 = 0603WAF4700T5E: LCSC Part Name: 470Ω ±1% 100mW 厚膜电阻; Supplier Part: C23179; Manufacturer: UNI-ROYAL(厚声); Supplier Footprint: 0603; JLCPCB Part Class: 基础库; Datasheet: https://atta.szlcsc.com/upload/public/pdf/source/20200306/C422600_1E6D84923E4A46A82E41ADD87F860B5C.pdf; Supplier: LCSC; Type: 厚膜电阻; Tolerance: ±1%; Power(Watts): 100mW; Overload Voltage (Max): 75V; Temperature Coefficient: ±100ppm/℃; Operating Temperature Range: -55℃~+155℃
R13 = 0603WAF1004T5E: LCSC Part Name: 1MΩ ±1% 100mW 厚膜电阻; Supplier Part: C22935; Manufacturer: UNI-ROYAL(厚声); Supplier Footprint: 0603; JLCPCB Part Class: 基础库; Datasheet: https://atta.szlcsc.com/upload/public/pdf/source/20200306/C422600_1E6D84923E4A46A82E41ADD87F860B5C.pdf; Supplier: LCSC; Type: 厚膜电阻; Tolerance: ±1%; Power(Watts): 100mW; Overload Voltage (Max): 75V; Temperature Coefficient: ±100ppm/℃; Operating Temperature Range: -55℃~+155℃
U1 = CXP0530-6R8M-AG(6.8uh): LCSC Part Name: 6.8uH ±20% 5A; Supplier Part: C7461350; Manufacturer: DMBJ(振宝佳); Supplier Footprint: 0530; JLCPCB Part Class: 扩展库; Datasheet: https://atta.szlcsc.com/upload/public/pdf/source/20230706/7F3A5B39C5AD80A91C9FA782B54A296B.pdf; Supplier: LCSC; Tolerance: ±20%; Rated Current: 3.5A; Saturation Current (Isat): 5A; DC Resistance (DCR): 70mΩ; Type: 一体成型电感
U2 U5 U6 = FRM121WFR050TM: LCSC Part Name: 50mΩ ±1% 1W; Supplier Part: C7467249; Manufacturer: FOJAN(富捷); Supplier Footprint: 1206; JLCPCB Part Class: 扩展库; Datasheet: https://atta.szlcsc.com/upload/public/pdf/source/20240709/7FCE84187288C94C67B1004F90EDDF14.pdf; Supplier: LCSC; Type: 采样电阻; Tolerance: ±1%; Power(Watts): 1W; Temperature Coefficient: ±50ppm/℃
U4 = SLM6305: LCSC Part Name: 宽输入电压2.5A单节锂电池充电管理IC; Supplier Part: C711584; Manufacturer: 无锡松朗微; Supplier Footprint: TDFN-10-EP(3x3); JLCPCB Part Class: 扩展库; Datasheet: https://atta.szlcsc.com/upload/public/pdf/source/20200723/C711584_2224278DBAF55B7B34A102BEBD70C238.pdf; Supplier: LCSC; The Chip Type: 降压充电芯片; Supply Voltage: 4V~26V; Maximum Charge Current: 2.5A; Charging Saturation Voltage: 4.2V; Type of Battery: 锂离子/聚合物; Number of Cells: 1; Operating Temperature: -40℃~+85℃
U7 = REF3033AIDBZR: Supplier Part: C36658; Manufacturer: TI(德州仪器); Supplier Footprint: SOT-23; JLCPCB Part Class: 扩展库; Datasheet: https://www.ti.com/cn/lit/gpn/ref3020; Supplier: LCSC; Output Type: 固定; Input Voltage: 3.35V~5.5V; Output Voltage: 3.3V; Output Current: 25mA; Tolerance: ±0.2%; Temperature Coefficient: 75ppm/℃; Reference Type: 串联; Supply Current: 50uA; Noise - 10Hz to 10kHz: 105uVrms; Operating Temperature: -40℃~+125℃@(Ta)
U9 U11 = SN74LVC1G32DBVR(UMW): LCSC Part Name: SN74LVC1G32DBVR; Supplier Part: C7394015; Manufacturer: UMW(友台半导体); Supplier Footprint: SOT23-5; JLCPCB Part Class: 扩展库; Datasheet: https://atta.szlcsc.com/upload/public/pdf/source/20231109/3EAF02383C1362A99BB32849DE41AE98.pdf; Supplier: LCSC
U10 = LMV331IDBVR: Supplier Part: C34731; Manufacturer: TI(德州仪器); Supplier Footprint: SOT-23-5; JLCPCB Part Class: 扩展库; Datasheet: https://www.ti.com/cn/lit/gpn/lmv331; Supplier: LCSC; Input Offset Voltage (Vos): 7mV; Input Bias Current (Ib): 250nA; Propagation Delay Time: 600ns; Supply Voltage: 2.7V~5.5V; Output Type: 开集; Supply Current: 150uA; Operating Temperature: -40℃~+85℃
U12-U14 = LM1117IMPX-3.3/NOPB: LCSC Part Name: 输入20V 输出3.3V 800mA; Supplier Part: C23984; Manufacturer: TI(德州仪器); Supplier Footprint: SOT-223; JLCPCB Part Class: 扩展库; Datasheet: http://www.ti.com/cn/lit/gpn/lm1117; Supplier: LCSC; Output Type: 固定; Maximum Input Voltage: 15V; Output Voltage: 3.3V; MAX Output Current: 800mA; Power Supply Rejection Ratio (PSRR): 75dB@(120Hz); Dropout Voltage: 1.2V@(800mA); standby current: 5mA; Operating Temperature: -40℃~+125℃; Output Polarity: 正极; Number of Outputs: 1
U15 = TPS61022RWUR: Supplier Part: C915088; Manufacturer: TI(德州仪器); Supplier Footprint: VQFN-7(2x2); JLCPCB Part Class: 扩展库; Datasheet: https://www.ti.com/cn/lit/gpn/tps61022; Supplier: LCSC; Function: 升压型; Output Type: 可调; Input Voltage: 500mV~5.5V; Output Voltage: 2.2V~5.5V; Switching Frequency: 1MHz；600kHz; Operating Temperature: -40℃~+125℃@(TJ); Synchronous Rectification: 是; Number of Outputs: 1; Topology: 升压式; Switch tube (built-in/external): 内置

## Nets
GND: C1.2 C2.2 C3.2 C4.2 C5.1 C6.1 C7.1 C8.1 C9.1 C11.2 C12.1 C13.1 C14.1 C17.1 C18.1 C19.1 C20.1 C21.1 C22.1 C23.1 C24.1 C25.1 C26.1 C27.1 C28.1 C29.1 C30.1 C31.1 C32.1 C33.1 C34.1 C35.1 C36.1 C37.1 C40.1 C41.1 C42.1 C43.1 C44.1 C47.1 C48.1 C50.2 C53.1 C54.1 C55.1 C56.1 C57.1 C60.1 C61.1 C63.2 C66.1 C67.1 C68.1 C69.1 C70.1 C73.1 C74.1 C76.2 C79.1 C80.1 C81.1 C82.1 C83.1 C86.1 C87.1 C89.2 C92.1 C93.1 C94.1 C95.1 C96.1 C99.1 C100.1 C102.2 C105.1 C106.1 C107.1 C108.1 C109.1 C112.1 C113.1 C115.2 C116.2 C117.1 C118.2 CN5.1(-) CN5.3 CN5.4 CN6.7 CN6.8 CN7.2 CN8.2 CN9.2 CN10.3 CN10.4 D2.2(A) D3.2(A) D4.2 D5.2 D6.2 DC2.2 F1.2 H2.3 H3.3 H4.3 H5.3 H6.3 H7.3 LED1.2(-) LED2.2(-) LED3.2(-) LED4.2(-) R1.1 R6.1 R9.2 R13.2 R15.1 R17.1 R33.1 R34.1 R43.1 R44.1 R53.1 R54.1 R63.1 R64.1 R73.1 R74.1 R83.1 R84.1 U4.5(NCE) U4.9(GND) U4.11(EP) U7.3(GND) U9.3(GND) U10.2(GND) U11.3(GND) U12.1(GND) U13.1(GND) U14.1(GND) U15.1(GND) U15.6(MODE) U18.5(GND) U20.5(GND) U22.5(GND) U24.5(GND) U26.5(GND) U28.5(GND)
VBAT+: C3.1 C4.1 C8.2 C9.2 C11.1 C13.2 C14.2 C116.1 C117.2 C118.1 CN5.2(+) Q1.3(D) Q2.3(D) Q3.3(D) Q4.3(D) R2.2 R7.2 SLM_VBAT.1 U2.2 U4.7(BAT) U6.2 U7.1(IN) U9.5(VCC) U10.3(IN-) U10.5(VCC+) U11.5(VCC)
VCC_3V3_A: C21.2 C23.2 C24.2 CN7.1 D4.1 R24.1 U14.2(OUT) U14.4(TAB)
VCC_3V3_B: C27.2 C29.2 C30.2 CN8.1 D5.1 U12.2(OUT) U12.4(TAB)
VCC_3V3_C: C33.2 C35.2 C36.2 CN9.1 D6.1 U13.2(OUT) U13.4(TAB)
VCC_5V: C19.2 C20.2 C22.2 C25.2 C26.2 C28.2 C31.2 C32.2 C34.2 CN10.1 CN10.2 D3.1(K) F2.2 R22.1 U12.3(IN) U13.3(IN) U14.3(IN)
VCC_7V4_A: C41.2 C42.2 F3.2 H2.2 R23.1
VCC_7V4_B: C54.2 C55.2 F4.2 H3.2
VCC_7V4_C: C67.2 C68.2 F5.2 H4.2
VCC_7V4_D: C80.2 C81.2 F6.2 H5.2
VCC_7V4_E: C93.2 C94.2 F7.2 H6.2
VCC_7V4_F: C106.2 C107.2 F8.2 H7.2
VCC_BAT: C5.2 C6.2 C7.2 C37.2 C44.2 C47.2 C57.2 C60.2 C70.2 C73.2 C83.2 C86.2 C96.2 C99.2 C109.2 C112.2 PMOS_S.1 Q1.2(S) Q2.2(S) Q3.2(S) Q4.2(S) R1.2 R21.1 U15.5(EN) U15.7(VIN) U16.2 U17.1 U18.9(VIN) U19.1 U20.9(VIN) U21.1 U22.9(VIN) U23.1 U24.9(VIN) U25.1 U26.9(VIN) U27.1 U28.9(VIN)
SERVO_PWM_A: CN6.6 H2.1
SERVO_PWM_B: CN6.5 H3.1
SERVO_PWM_C: CN6.4 H4.1
SERVO_PWM_D: CN6.3 H5.1
SERVO_PWM_E: CN6.2 H6.1
SERVO_PWM_F: CN6.1 H7.1
V_BC+: C1.1 C2.1 C10.2 DC2.1 NTC1.1 R3.1 R4.2 R14.2 U4.1(VIN)
V_BC-: DC2.3
$1N8713: C10.1 U4.2(VGC)
$1N9378: D1.2(A) D2.1(K)
$1N9790: U1.1 U4.10(LX)
$1N9922: U5.2 U6.1
$1N9964: U1.2 U2.1 U4.8(VS) U5.1
$1N10384: F1.1 R12.2
$1N10479: LED_G.1(+) LED_R.1(+) R3.2
$1N10484: LED_R.2(-) U4.3(NCHRG)
$1N10577: LED_G.2(-) U4.4(NSTDBY)
$1N10912: OR2_OUT.1 Q1.1(G) Q2.1(G) Q3.1(G) Q4.1(G) R13.1 U11.4(Y)
$1N15028: OR1_B.1 R14.1 R15.2 U9.2(B)
$1N15144: OR1_OUT.1 U9.4(Y) U11.2(B)
$1N15467: H1.2 R2.1 R6.2
$1N18572: R9.1 R10.1 U10.1(IN+)
$1N18575: R10.2 REF.1 U7.2(OUT)
$1N30083: U15.2(SW) U16.1
$1N30214: R16.2 R18.1 R20.2
$1N30218: R16.1 R19.2 R20.1
$1N30435: R17.2 R18.2 U15.4(FB)
$1N32600: C17.2 C18.2 F2.1 R19.1 U15.3(VOUT)
$1N40225: LED1.1(+) R21.2
$1N40271: LED2.1(+) R22.2
$1N40739: LED3.1(+) R23.2
$1N40843: LED4.1(+) R24.2
$1N46493: D1.1(K) R85.1
$1N46536: R4.1 R85.2
$3N1090: R28.1 R29.2
$3N1091: R27.1 R32.2 U18.3(FB)
$3N1092: R26.2 R27.2
$3N1093: C49.1 C50.1
$3N1094: R32.1 R33.2
$3N1095: C49.2 R29.1
$3N1096: C43.2 U18.2(VCC) U18.7(EN)
$3N1097: R30.1 R31.2
$3N1098: C38.1 R25.1 U17.2 U18.11(SW)
$3N1099: R31.1 R34.2
$3N1101: R30.2 U18.8(ILIM)
$3N1102: C38.2 U18.10(BOOT)
$3N1104: C48.2 R28.2 U18.4(COMP)
$3N1106: C40.2 F3.1 R26.1 U18.6(VOUT)
$3N1107: R25.2 U18.1(FSW)
$3N2147: R40.1 R41.2
$3N2148: R40.2 U20.8(ILIM)
$3N2149: R41.1 R44.2
$3N2153: C51.1 R35.1 U19.2 U20.11(SW)
$3N2154: C56.2 U20.2(VCC) U20.7(EN)
$3N2155: C51.2 U20.10(BOOT)
$3N2156: C53.2 F4.1 R36.1 U20.6(VOUT)
$3N2157: R35.2 U20.1(FSW)
$3N2159: C61.2 R38.2 U20.4(COMP)
$3N2160: R37.1 R42.2 U20.3(FB)
$3N2163: R36.2 R37.2
$3N2164: C62.1 C63.1
$3N2165: C62.2 R39.1
$3N2166: R38.1 R39.2
$3N2167: R42.1 R43.2
$3N3203: R50.1 R51.2
$3N3204: R50.2 U22.8(ILIM)
$3N3205: R51.1 R54.2
$3N3209: C64.1 R45.1 U21.2 U22.11(SW)
$3N3210: C69.2 U22.2(VCC) U22.7(EN)
$3N3211: C64.2 U22.10(BOOT)
$3N3212: C66.2 F5.1 R46.1 U22.6(VOUT)
$3N3213: R45.2 U22.1(FSW)
$3N3215: C74.2 R48.2 U22.4(COMP)
$3N3216: R47.1 R52.2 U22.3(FB)
$3N3219: R46.2 R47.2
$3N3220: C75.1 C76.1
$3N3221: C75.2 R49.1
$3N3222: R48.1 R49.2
$3N3223: R52.1 R53.2
$3N4259: R60.1 R61.2
$3N4260: R60.2 U24.8(ILIM)
$3N4261: R61.1 R64.2
$3N4265: C77.1 R55.1 U23.2 U24.11(SW)
$3N4266: C82.2 U24.2(VCC) U24.7(EN)
$3N4267: C77.2 U24.10(BOOT)
$3N4268: C79.2 F6.1 R56.1 U24.6(VOUT)
$3N4269: R55.2 U24.1(FSW)
$3N4271: C87.2 R58.2 U24.4(COMP)
$3N4272: R57.1 R62.2 U24.3(FB)
$3N4275: R56.2 R57.2
$3N4276: C88.1 C89.1
$3N4277: C88.2 R59.1
$3N4278: R58.1 R59.2
$3N4279: R62.1 R63.2
$3N5315: R70.1 R71.2
$3N5316: R70.2 U26.8(ILIM)
$3N5317: R71.1 R74.2
$3N5321: C90.1 R65.1 U25.2 U26.11(SW)
$3N5322: C95.2 U26.2(VCC) U26.7(EN)
$3N5323: C90.2 U26.10(BOOT)
$3N5324: C92.2 F7.1 R66.1 U26.6(VOUT)
$3N5325: R65.2 U26.1(FSW)
$3N5327: C100.2 R68.2 U26.4(COMP)
$3N5328: R67.1 R72.2 U26.3(FB)
$3N5331: R66.2 R67.2
$3N5332: C101.1 C102.1
$3N5333: C101.2 R69.1
$3N5334: R68.1 R69.2
$3N5335: R72.1 R73.2
$3N6371: R80.1 R81.2
$3N6372: R80.2 U28.8(ILIM)
$3N6373: R81.1 R84.2
$3N6377: C103.1 R75.1 U27.2 U28.11(SW)
$3N6378: C108.2 U28.2(VCC) U28.7(EN)
$3N6379: C103.2 U28.10(BOOT)
$3N6380: C105.2 F8.1 R76.1 U28.6(VOUT)
$3N6381: R75.2 U28.1(FSW)
$3N6383: C113.2 R78.2 U28.4(COMP)
$3N6384: R77.1 R82.2 U28.3(FB)
$3N6387: R76.2 R77.2
$3N6388: C114.1 C115.1
$3N6389: C114.2 R79.1
$3N6390: R78.1 R79.2
$3N6391: R82.1 R83.2
Net-(C12-2): C12.2 Compare_out.1 R7.1 U10.4(OUT) U11.1(A)
Net-(H1-1): H1.1 OR1_A?#1.1 U9.1(A)
Net-(NTC1-2): NTC1.2 R12.1 SLM_TEMP.1 U4.6(NTC)

## Notes on the sheets
sheet 1
- 50mR电阻要500mW的
- 这里放一个开关，
  因为要安装到外壳上，所以外接
- 比较器高电位带不动
  或门时，可以上拉
- 假如要2V5基准
  分压
- 3A 跳闸，防止NTC坏了，
  导致V_BC+接地；
- 快速泄放G极，
  出问题的话拆了
- 假如电流太小带不动
  就换个电阻
- 比较器输出上拉时，
  这里用15pf
- 2.充放电分离
  3.防反接
  4.开关
- V_BC+ = 8V4
  电容耐压选16V的
- SI2305:
  V_SD(MAX)=-1.2V
  V_GS(th)(MIN)=-0.5V ; V_GS(th)(TPY)=-1.5V
  R_DS(on)=50mR
- 1.电池充电电路
- 电池输出部分
- 这里接5V
  别直接接电池
  以免电池电压降到3V3以下时失效；
- 3A保险丝
- 5V 升压
- 降压3V3
- 连接控制板的PWM输出
- 注意靠近小圆点的1脚，
  默认接正极
- 注意靠近小圆点的1脚，
  默认接正极
- 注意靠近小圆点的1脚，
  这里接信号
- 用于连接控制板
  PCA9685输出PWM
- SH 1.0mm 6P 卧贴
- 3V3 座子
- XH2.54mm 1x2P 弯插
- 5V 座子
- XH2.54mm 1x4P 直插
- 舵机座子
- 排针2.54mm 1x3P 直插
- 这里注意，都是用A的，
  因为过多LED会占用面积和电流
  实际运行前可以测试一下
- LED指示灯
sheet 2
- 1.1A 保险丝
- 怕电机影响，
  拿来滤波
